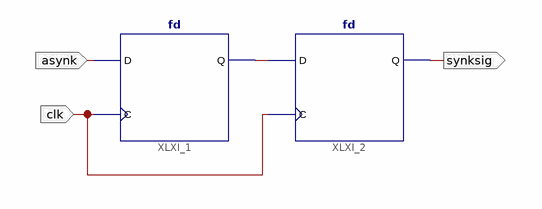
[diagram p0: schematic sheet 1]
// Xilinx ISE schematic sync.sch (xc9500xl) as structural Verilog: 2 symbols, 3 ports
module sync (
  input  asynk,
  input  clk,
  output synksig
);

  wire XLXN_1;

  fd XLXI_1 (.C(clk), .D(asynk), .Q(XLXN_1));
  fd XLXI_2 (.C(clk), .D(XLXN_1), .Q(synksig));
endmodule
